# EasyEDA Pro project ProPrj_飞行器设计之5.8Ghz图传_2025-12-20.epro, board PCB_2
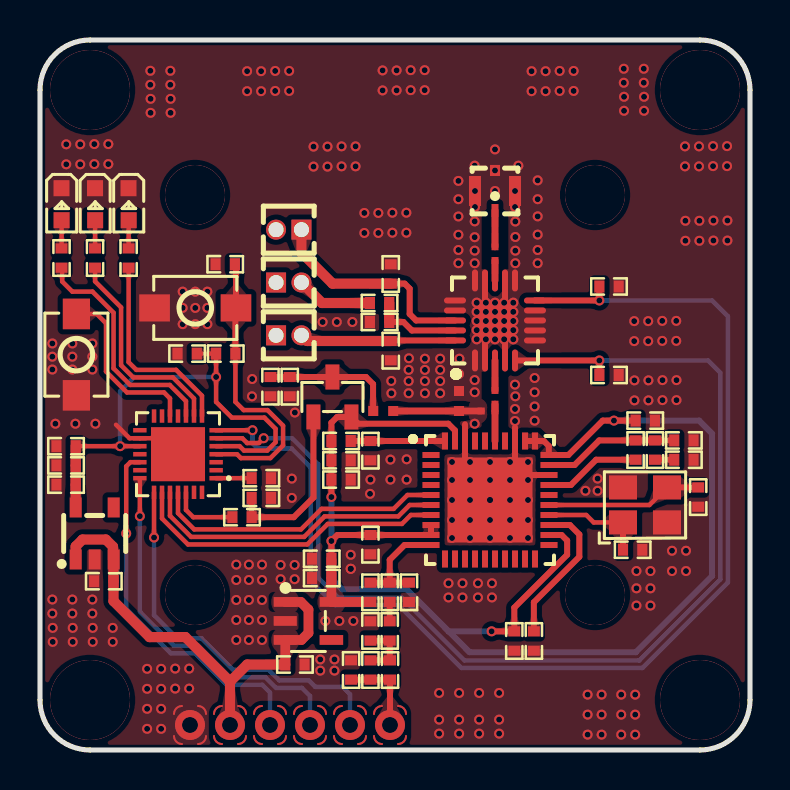
[diagram p11: board, top side]
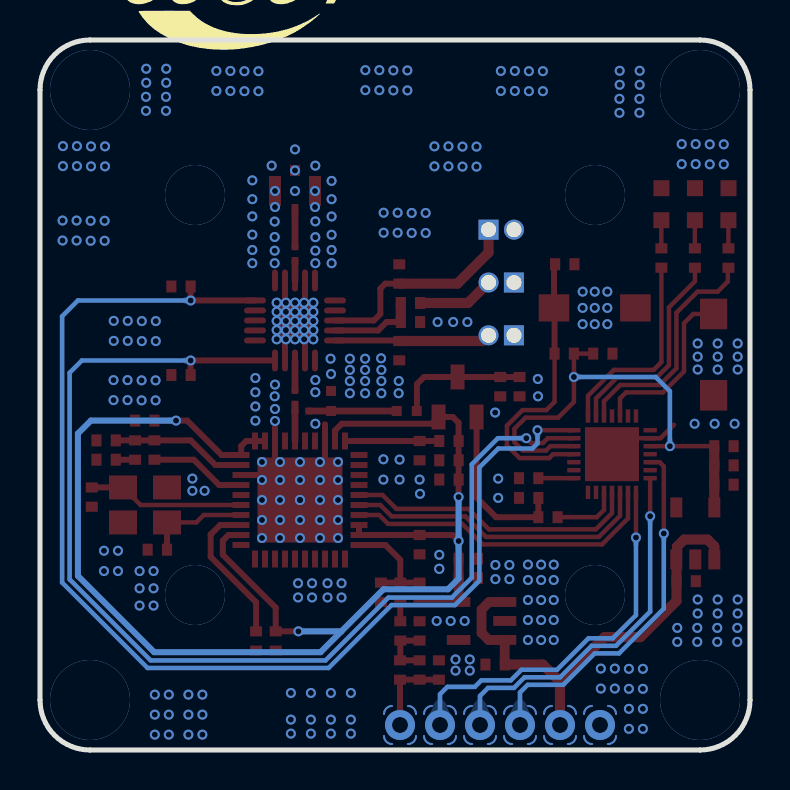
[diagram p12: board, bottom side, seen from below]

Outline 35.5 x 35.5 mm; copper layers: Top Layer, Inner1, Inner2, Bottom Layer. Coordinates in mm from the lower left corner of the outline.
Outline path: 0,33 arc(0.73,34.77) 2.5,35.5 33,35.5 arc(34.77,34.77) 35.5,33 35.5,2.5 arc(34.77,0.73) 33,0 2.5,0 arc(0.73,0.73) 0,2.5 0,33
Stack: Top Layer 0.035mm / Dielectric1 0.48mm PP er 4.5 / Inner1 0.035mm / Dielectric2 0.48mm FR4 er 4.5 / Inner2 0.035mm / Dielectric3 0.48mm PP er 4.5 / Bottom Layer 0.035mm

## Design rules (mm)
spacing safeClearance (default): track to track 0.152, other pairs 0.152 to 0.3
spacing Plane_innerPlane: track to track 0.152, other pairs 0.152 to 0.3
spacing Copper_copperRegion: track to track 0.152, other pairs 0.152 to 0.3
track width trackWidth (default): min 0.127, default 0.254, max 2.54
differential pair differentialPair (default): width min 0.127, default 0.254, max 2.54; gap min 0.152, default 0.152
pour e689 uses Copper_copperRegion
pour e694 uses Copper_copperRegion

## Placement (name value [footprint] x y rotation side)
C1  2.2uF  [C0402]  16.98 21.4 180 top
C2  2.2uF  [C0402]  17.54 19.97 90 top
C3  2.2uF  [C0402]  17.54 23.8 90 top
C4  1uF  [C0402]  11.52 18.17 90 top
C5  20pF  [C0402-0.5]  20.95 17.45 270 top
C6  7.3pF  [c0201]  22.75 17.63 90 top
C7  10pF  [c0201]  22.75 24.82 90 top
C8  1nF  [C0402]  28.45 18.75 0 top
C9  10pF  [C0402]  28.45 23.18 180 top
C10  1uF  [C0402]  15.05 14.48 180 top
C11  1uF  [C0402]  15.05 13.52 180 top
C12  10uf  [C0402]  12.49 18.17 90 top
C13  10pF  [C0402]  29.63 10.01 0 top
C14  10pF  [C0402]  32.91 12.65 270 top
C16  1nF  [C0402]  16.52 14.97 270 top
C17  4.7uF  [C0402]  30.26 16.47 180 top
C18  4.7uF  [C0402]  32.19 14.51 180 top
C19  1uF  [C0402]  32.19 15.48 180 top
C20  1uF  [C0402]  3.19 8.44 0 top
C21  104  [C0402]  1.3 14.23 0 top
C22  10uF  [C0402]  1.3 13.27 0 top
C23  1uF  [C0402]  16.52 10.27 270 top
C24  470nF  [C0402]  24.69 5.45 270 top
C25  4.7uF  [C0402]  17.49 5.95 270 top
C26  1uF  [C0402]  23.72 5.45 270 top
C27  56pF  [C0402]  16.52 4 90 top
C28  104  [C0402]  9.26 24.29 180 top
C29  104  [C0402]  7.36 19.82 180 top
C30  104  [C0402]  1.3 15.19 180 top
C32  10uf  [C0402]  11.07 12.61 180 top
C33  1uF  [C0402]  12.75 4.27 180 top
C34  104  [C0402]  14.09 9.56 0 top
C35  10uF  [C0402]  14.09 8.6 0 top
H1  KH-1.27PH180-1X2P-L7.2  [HDR-TH_2P-P1.27-V-M]  12.44 23.38 0 top
H2  KH-1.27PH180-1X2P-L7.2  [HDR-TH_2P-P1.27-V-M]  12.44 20.73 0 top
H3  KH-1.27PH180-1X2P-L7.2  [HDR-TH_2P-P1.27-V-M]  12.44 26.02 180 top
L1  12nH  [l0201]  22.41 16.95 0 top
LDO1  XC6204B332MR  [SOT-23-5_L3.0-W1.7-P0.95-LS2.8-BR]  2.74 10.83 270 top
LED1  XL-1608UBC-04  [LED0603-RD_BLUE]  1.08 27.29 270 top
LED2  XL-1608UBC-04  [LED0603-RD_BLUE]  2.75 27.29 270 top
LED3  XL-1608UBC-04  [LED0603-RD_BLUE]  4.43 27.29 270 top
Q1  FDN338P  [SOT-23-3_L2.9-W1.3-P1.90-LS2.4-BR]  14.62 17.65 270 top
R1  10ohm  [R0402-0.5]  17.16 16.95 180 top
R3  51ohm  [R0402]  15.05 15.45 180 top
R8  47k  [R0402]  30.75 15 270 top
R11  100k  [R0402]  29.78 15 90 top
R15  510k  [R0402]  16.52 7.89 270 top
R16  200ohm  [R0402]  16.52 5.95 270 top
R17  3.3k  [R0402]  17.49 7.89 90 top
R18  560K  [R0402]  18.45 7.89 90 top
R19  1.2k  [R0402]  17.5 4 90 top
R20  82ohm  [R0402]  15.56 4 270 top
R21  0ohm  [R0402]  16.98 22.35 180 top
R22  10K  [R0402]  11.07 13.59 180 top
R23  10K  [R0402]  9.29 19.82 0 top
R24  330Ω  [R0402]  1.08 24.6 90 top
R25  330Ω  [R0402]  2.75 24.6 90 top
R26  330Ω  [R0402]  4.43 24.6 90 top
R27  3.3kΩ  [R0402]  10.1 11.64 0 top
RF3  SP-RF-003  [IPEX-SMD_SP-RF-003]  22.75 27.98 90 top
SW3  TS342A2P-WZ  [SW-SMD_L4.0-W2.9-LS5.0]  7.76 22.11 0 top
SW4  TS342A2P-WZ  [SW-SMD_L4.0-W2.9-LS5.0]  1.82 19.77 270 top
T1  -  [test_pad#3]  13.5 1.25 270 bottom
T2  -  [TEST_PAD]  13.5 1.25 90 top
T3  -  [test_pad#4]  13.17 -2.53 270 bottom
T4  -  [test_pad]  9.46 -1.16 90 top
T5  -  [test_pad#5]  11.14 -5.63 270 bottom
T6  -  [test_pad#2]  8.75 -4.87 90 top
T7  -  [TEST_PAD]  17.5 1.25 90 top
T8  -  [TEST_PAD]  17.5 1.25 270 bottom
T9  -  [TEST_PAD]  11.5 1.25 270 bottom
T10  -  [TEST_PAD]  11.5 1.25 90 top
T11  -  [test_pad#3]  15.5 1.25 270 bottom
T12  -  [TEST_PAD]  15.5 1.25 90 top
U1  RFPA5542TR13  [QFN-20_L4.0-W4.0]  22.75 21.48 0 top
U3  -  [QFN-40-1]  22.5 12.5 0 top
U4  GD32F130G6U6TR  [QFN-28_L4.0-W4.0-P0.40-BL-EP]  6.9 14.79 90 top
U5  LP3992-36B5F  [SOT-23-5_L3.0-W1.7-P0.95-LS2.8-BL]  13.42 6.45 270 top
X3  8MHz  [OSC-SMD_4P-L3.2-W2.5-BL]  30.25 12.25 0 top

## Footprints (pads in the part's own frame, mm; a bottom-side part is the same pattern mirrored in y, then rotated)
c0201
  rect 0.343x0.343 smd: 1(-0.343,0) 2(0.343,0)
C0402
  rect 0.508x0.6 smd: 1(-0.483,0) 2(0.483,0)
C0402-0.5
  rect 0.5x0.5 smd: 1(-0.5,0) 2(0.5,0)
HDR-TH_2P-P1.27-V-M
  rect 1.001x1.001 hole 0.75: 1(-0.635,0)
  round 1.001 hole 0.75: 2(0.635,0)
IPEX-SMD_SP-RF-003
  rect 0.65x0.343 smd: 1(-1.001,0)
  rect 0.551x0.5 smd: 2(1.001,0)
  rect 1.501x0.6 smd: 3(-0.025,1.001) 4(-0.025,-1.001)
l0201
  rect 0.343x0.343 smd: 1(-0.343,0) 2(0.343,0)
LED0603-RD_BLUE
  rect 0.8x0.8 smd: 1(-0.8,-0.003) 2(0.8,0.003)
OSC-SMD_4P-L3.2-W2.5-BL
  rect 1.4x1.2 smd: 1(-1.1,-0.875) 2(1.1,-0.875) 3(1.1,0.875) 4(-1.1,0.875)
QFN-20_L4.0-W4.0
  oval 0.3x1.1 smd: 1(-1,-2) 2(-0.5,-2) 3(0,-2) 4(0.5,-2) 5(1,-2) 11(1,2) 12(0.5,2) 13(0,2) 14(-0.5,2) 15(-1,2)
  oval 1.1x0.3 smd: 6(2,-1) 7(2,-0.5) 8(2,0) 9(2,0.5) 10(2,1) 16(-2,1) 17(-2,0.5) 18(-2,0) 19(-2,-0.5) 20(-2,-1)
  rect 2x2 smd: 21(0,0)
QFN-28_L4.0-W4.0-P0.40-BL-EP
  rect 0.224x0.665 smd: 1(-1.199,-1.907) 2(-0.8,-1.907) 3(-0.399,-1.907) 4(0,-1.907) 5(0.402,-1.907) 6(0.8,-1.907) 7(1.199,-1.907) 15(1.199,1.907) 16(0.8,1.907) 17(0.402,1.907) 18(0,1.907) 19(-0.399,1.907) 20(-0.8,1.907) 21(-1.199,1.907)
  rect 0.665x0.224 smd: 8(1.907,-1.199) 9(1.907,-0.8) 10(1.907,-0.399) 11(1.907,0) 12(1.907,0.402) 13(1.907,0.8) 14(1.907,1.199) 22(-1.907,1.199) 23(-1.907,0.8) 24(-1.907,0.402) 25(-1.907,0) 26(-1.907,-0.399) 27(-1.907,-0.8) 28(-1.907,-1.199)
  rect 2.7x2.7 smd: 29(0,0)
QFN-40-1
  rect 0.85x0.3 smd: 1(-2.95,2.25) 2(-2.95,1.75) 3(-2.95,1.25) 4(-2.95,0.75) 5(-2.95,0.25) 6(-2.95,-0.25) 7(-2.95,-0.75) 8(-2.95,-1.25) 9(-2.95,-1.75) 10(-2.95,-2.25) 21(2.95,-2.25) 22(2.95,-1.75) 23(2.95,-1.25) 24(2.95,-0.75) 25(2.95,-0.25) 26(2.95,0.25) 27(2.95,0.75) 28(2.95,1.25) 29(2.95,1.75) 30(2.95,2.25)
  rect 0.3x0.85 smd: 11(-2.25,-2.95) 12(-1.75,-2.95) 13(-1.25,-2.95) 14(-0.75,-2.95) 15(-0.25,-2.95) 16(0.25,-2.95) 17(0.75,-2.95) 18(1.25,-2.95) 19(1.75,-2.95) 20(2.25,-2.95) 31(2.25,2.95) 32(1.75,2.95) 33(1.25,2.95) 34(0.75,2.95) 35(0.25,2.95) 36(-0.25,2.95) 37(-0.75,2.95) 38(-1.25,2.95) 39(-1.75,2.95) 40(-2.25,2.95)
  rect 4.25x4.25 smd: 41(0,0)
R0402
  rect 0.508x0.6 smd: 1(-0.483,0) 2(0.483,0)
R0402-0.5
  rect 0.5x0.5 smd: 1(-0.5,0) 2(0.5,0)
SOT-23-3_L2.9-W1.3-P1.90-LS2.4-BR
  rect 1.25x0.7 smd: 1(1,-0.95) 2(1,0.95) 3(-1,0)
SOT-23-5_L3.0-W1.7-P0.95-LS2.8-BL
  rect 0.49x1.157 smd: 1(-0.95,-1.153) 2(0,-1.153) 3(0.95,-1.153)
  rect 0.49x1.175 smd: 4(0.95,1.153) 5(-0.95,1.153)
SOT-23-5_L3.0-W1.7-P0.95-LS2.8-BR
  rect 1x0.6 smd: 1(1.3,-0.95) 2(1.3,0) 3(1.3,0.95) 4(-1.3,0.95) 5(-1.3,-0.95)
SW-SMD_L4.0-W2.9-LS5.0
  rect 1.53x1.36 smd: 1(-2.035,0) 2(2.035,0)
TEST_PAD
  custom 1.9x1.6 smd: 1(0,0)
test_pad
  custom 1.9x1.6 smd: 1(2.408,-0.041)
test_pad#2
  custom 1.9x1.6 smd: 1(6.116,1.248)
test_pad#3
  custom 1.9x1.6 smd: 1(0,0)
test_pad#4
  custom 1.9x1.6 smd: 1(-3.779,3.668)
test_pad#5
  custom 1.9x1.6 smd: 1(-6.878,3.636)

## Nets
As in the schematic.

Pads without a net: LDO1 4; U3 1 2 3 4 11 12 13 14 15 16 17 18 19 20 21 26 34 36 37; U4 2 3 11 13 14 15 18 20 27 28; U5 4

## Via types
v1: diameter 4, hole 4, Top Layer to Bottom Layer, 4 vias
v2: diameter 3, hole 3, Top Layer to Bottom Layer, 4 vias
v3: diameter 0.5, hole 0.3, Top Layer to Bottom Layer, 326 vias
v4: diameter 0.508, hole 0.305, Top Layer to Bottom Layer, 25 vias
v5: diameter 1.5, hole 0.8, Top Layer to Bottom Layer, 6 vias

## Routing (per net, layer and track width the routed paths; a pad name or vN(x,y) marks a point on that pad's centre or on a via; arc(x,y) is an arc through that point)
+3.3VGD: length 24.9
  Top Layer w0.224: C29.1 R23.1 v3(8.81,18.65) 8.81,17.41 9.59,16.62 11.22,16.62 11.78,16.06 11.78,15.39 11.36,14.97 10.2,14.97 9.98,15.19 U4.5 ; U4.17 v3(4,15.19) C30.1
  Top Layer w0.508: C30.1 C21.2 C22.2 1.78,12.13
  Bottom Layer w0.224: v3(4,15.19) 4,17.94 4.72,18.65 v3(8.81,18.65)
+3.6V: length 76.7
  Top Layer w0.3: v3(14.57,12.65) C11.2 C10.2 R3.2 14.57,16.36 14.86,16.65 Q1.2 15.91,16.31 20.41,16.31 20.75,15.98 U3.39 ; U3.22 26.08,10.75 26.36,10.47 26.36,9.76 23.72,7.12 C26.1 v3(22.58,5.93) ; C17.2 v3(28.7,16.47) 28.14,16.47 26.42,14.75 U3.30 25.44,14.76 25.44,15.2 25.19,15.45 U3.31 U3.32 ; U3.8 U3.9 C23.1 14.87,10.75 v3(14.57,10.45) C34.2
  Top Layer w0.49: C34.2 C35.2 U5.5 R15.2
  Bottom Layer w0.3: v3(22.58,5.93) 20.43,5.93 ; 20.43,5.93 18.33,8.04 15.1,8.04 14.57,8.57 v3(14.57,10.45) v3(14.57,12.65) ; 20.43,5.93 21.47,4.89 29.79,4.89 33.6,8.7 33.6,15.82 32.96,16.47 v3(28.7,16.47)
+4V5: length 23.3
  Top Layer w0.49: C33.2 U5.3 13.07,5.5 13.42,5.85 13.42,7.02 13.04,7.4 U5.1
  Top Layer w0.508: 1.78,9.53 1.78,10.18 2.12,10.52 3.29,10.52 3.65,10.17 3.65,9.54 3.68,9.52 ; 3.68,9.52 C20.2 3.68,7.45 5.48,5.65 7.27,5.65 9.5,3.42 ; 3.68,9.52 LDO1.3 ; v5(9.5,1.25) 9.5,3.42 ; 9.5,3.42 10.36,4.27 C33.2
GND: length 22.7
  Top Layer w0.224: U4.29 6.1,15.59 U4.16 4.47,15.59 3.8,16.26
  Top Layer w0.3: 23.75,13.75 U3.33 23.75,16.13 ; 23.75,13.75 U3.28 ; 23.75,13.75 v3(23.5,13.5) v3(22.5,12.5) v3(21.5,13.5) 21.25,13.75 U3.38 21.25,16.29 ; 22.74,21.46 v4(22.75,21.45) ; 22.74,21.46 22.25,21.95 U1.14 ; 22.74,21.46 22.25,20.98 U1.2 ; 22.74,21.46 U1.21 ; v4(22.75,21.45) 23.25,21.95 U1.12 ; v4(22.75,21.45) 23.25,20.95 U1.4
  vias: v3(0.62,20.33) v3(0.62,19.67) v3(0.62,19.02) v3(0.62,7.53) v3(0.62,6.83) v3(0.64,6.11) v3(0.64,5.41) v3(0.77,16.31) v3(1.31,30.28) v3(1.31,29.28) v3(1.62,20.33) v3(1.62,19.67) v3(1.62,19.02) v3(1.62,7.53) v3(1.62,6.83) v3(1.64,6.11) v3(1.64,5.41) v3(1.77,16.31) v3(2.01,30.28) v3(2.01,29.28) v3(2.62,20.33) v3(2.62,19.67) v3(2.62,19.02) v3(2.62,7.53) v3(2.62,6.83) v3(2.64,6.11) v3(2.64,5.41) v3(2.72,30.3) v3(2.72,29.3) v3(2.77,16.31) v3(3.42,30.3) v3(3.42,29.3) v3(3.64,6.11) v3(3.64,5.41) v3(5.36,4.06) v3(5.36,3.06) v3(5.36,2.06) v3(5.36,1.06) v3(5.52,33.96) v3(5.52,33.26) v3(5.53,32.56) v3(5.53,31.86) v3(6.06,4.06) v3(6.06,3.06) v3(6.06,2.06) v3(6.06,1.06) v3(6.52,33.96) v3(6.52,33.26) v3(6.53,32.56) v3(6.53,31.86) v3(6.76,4.07) v3(6.76,3.07) v3(7.13,22.92) v3(7.13,22.11) v3(7.13,21.29) v3(7.46,4.07) v3(7.46,3.07) v3(7.76,22.92) v3(7.76,22.11) v3(7.76,21.29) v3(8.37,22.92) v3(8.37,22.11) v3(8.37,21.29) v3(9.81,9.27) v3(9.81,8.5) v3(9.81,7.5) v3(9.81,6.5) v3(9.81,5.5) v3(10.36,33.94) v3(10.36,32.94) v3(10.44,9.27) v3(10.44,8.5) v3(10.44,7.5) v3(10.44,6.5) v3(10.44,5.5) v3(10.61,18.55) v3(10.6,17.68) v3(11.06,33.94) v3(11.06,32.94) v3(11.1,9.27) v3(11.1,8.5) v3(11.1,7.5) v3(11.1,6.5) v3(11.1,5.5) v3(11.76,33.95) v3(11.76,32.95) v3(12.03,9.25) v3(12.03,8.54) v3(12.46,33.95) v3(12.46,32.95) v3(12.59,13.57) v3(12.59,12.61) v3(12.74,16.87) v3(12.73,9.25) v3(12.73,8.54) v3(13.68,30.17) v3(13.68,29.17) v3(14.01,4.53) v3(14.01,3.97) v3(14.13,21.4) v3(14.27,6.45) v3(14.38,30.17) v3(14.38,29.17) v3(14.72,4.53) v3(14.72,3.97) v3(14.84,21.4) v3(14.97,6.45) v3(15.08,30.18) v3(15.08,29.18) v3(15.54,9.76) v3(15.54,9.06) v3(15.54,9.06) v3(15.62,21.4) v3(15.67,6.45) v3(15.78,30.18) v3(15.78,29.18) v3(16.22,26.85) v3(16.22,25.85) v3(16.52,13.52) v3(16.5,12.81) v3(16.92,26.85) v3(16.92,25.85) v3(17.13,33.98) v3(17.13,32.98) v3(17.52,14.52) v3(17.52,13.52) v3(17.62,26.86) v3(17.62,25.86) v3(17.56,18.45) v3(17.57,17.84) v3(17.83,33.98) v3(17.83,32.98) v3(18.32,26.86) v3(18.32,25.86) v3(18.33,14.54) v3(18.33,13.52) v3(18.45,19.59) v3(18.43,19.01) v3(18.43,18.45) v3(18.43,17.84) v3(18.53,33.99) v3(18.53,32.99) v3(19.23,33.99) v3(19.23,32.99) v3(19.25,19.57) v3(19.25,19.01) v3(19.25,18.45) v3(19.25,17.84) v3(20.01,19.57) v3(20.01,19.01) v3(20.01,18.45) v3(20.01,17.84) v3(19.96,2.85) v3(19.96,1.52) v3(19.96,0.82) v3(20.42,8.34) v3(20.42,7.63) v3(20.6,14.4) v3(20.6,13.5) v3(20.6,12.5) v3(20.6,11.5) v3(20.6,10.6) v3(20.92,28.46) v3(20.92,27.54) v3(20.92,26.68) v3(20.92,25.76) v3(20.92,25) v3(20.92,24.34) v3(20.97,19.57) v3(20.95,18.8) v3(20.96,2.85) v3(20.96,1.52) v3(20.96,0.82) v3(21.12,8.34) v3(21.12,7.63) v3(21.5,14.4) v3(21.5,12.5) v3(21.5,11.5) v3(21.5,10.6) v3(21.73,29.22) v3(21.75,27.95) v3(21.75,27.15) v3(21.73,26.43) v3(21.73,25.64) v3(21.73,24.97) v3(21.73,24.34) v3(21.73,18.5) v3(21.73,17.89) v3(21.73,16.31) v3(21.9,8.34) v3(21.9,7.63) v3(21.96,2.85) v3(21.96,1.52) v3(21.96,0.82) v3(22.5,14.4) v3(22.5,13.5) v3(22.5,11.5) v3(22.5,10.6) v3(22.6,8.34) v3(22.6,7.63) v3(22.75,30.03) v3(22.75,28.98) v3(22.75,27.95) v3(22.96,2.85) v3(22.96,1.52) v3(22.96,0.82) v3(23.5,14.4) v3(23.5,12.5) v3(23.5,11.5) v3(23.5,10.6) v3(23.75,18.27) v3(23.75,17.05) v3(23.75,16.45) v3(23.75,27.95) v3(23.75,27.15) v3(23.77,26.42) v3(23.77,25.65) v3(23.77,24.97) v3(23.77,24.34) v3(23.77,17.69) v3(23.92,29.22) v3(24.4,14.4) v3(24.4,13.5) v3(24.4,12.5) v3(24.4,11.5) v3(24.4,10.6) v3(24.58,33.94) v3(24.58,32.94) v3(24.73,18.6) v3(24.73,17.89) v3(24.73,17.18) v3(24.73,16.47) v3(24.88,28.48) v3(24.88,27.54) v3(24.88,26.68) v3(24.88,25.77) v3(24.88,25) v3(24.88,24.34) v3(25.28,33.94) v3(25.28,32.94) v3(25.98,33.95) v3(25.98,32.95) v3(26.68,33.95) v3(26.68,32.95) v3(27.27,12.96) v3(27.38,2.77) v3(27.38,1.77) v3(27.38,0.77) v3(27.88,13.57) v3(27.88,12.96) v3(28.08,2.77) v3(28.08,1.77) v3(28.08,0.77) v3(29.06,2.77) v3(29.06,1.77) v3(29.06,0.77) v3(29.19,34.06) v3(29.19,33.36) v3(29.2,32.66) v3(29.2,31.96) v3(29.71,21.44) v3(29.71,20.44) v3(29.72,18.48) v3(29.72,17.48) v3(29.82,8.95) v3(29.82,8.08) v3(29.82,7.22) v3(29.76,2.77) v3(29.76,1.77) v3(29.76,0.77) v3(30.19,34.06) v3(30.19,33.36) v3(30.2,32.66) v3(30.2,31.96) v3(30.41,21.44) v3(30.41,20.44) v3(30.42,18.48) v3(30.42,17.48) v3(30.52,8.95) v3(30.52,8.08) v3(30.52,7.22) v3(31.11,21.46) v3(31.11,20.46) v3(31.12,18.49) v3(31.12,17.49) v3(31.6,9.96) v3(31.6,8.95) v3(31.81,21.46) v3(31.81,20.46) v3(31.82,18.49) v3(31.82,17.49) v3(32.25,30.18) v3(32.25,29.18) v3(32.27,26.46) v3(32.27,25.46) v3(32.3,9.96) v3(32.3,8.95) v3(32.95,30.18) v3(32.95,29.18) v3(32.97,26.46) v3(32.97,25.46) v3(33.65,30.19) v3(33.65,29.19) v3(33.67,26.47) v3(33.67,25.47) v3(34.35,30.19) v3(34.35,29.19) v3(34.37,26.47) v3(34.37,25.47) v4(21.84,22.36) v4(21.84,21.91) v4(21.84,21.45) v4(21.84,20.99) v4(21.84,20.54) v4(22.29,22.36) v4(22.29,21.91) v4(22.29,21.45) v4(22.29,20.99) v4(22.29,20.54) v4(22.75,22.36) v4(22.75,21.91) v4(22.75,20.99) v4(22.75,20.54) v4(23.21,22.36) v4(23.21,21.91) v4(23.21,21.45) v4(23.21,20.99) v4(23.21,20.54) v4(23.66,22.36) v4(23.66,21.91) v4(23.66,21.45) v4(23.66,20.99) v4(23.66,20.54) v5(7.5,1.25)
(no net):
  vias: v1(2.5,33) v1(2.5,2.5) v1(33,33) v1(33,2.5) v2(7.75,27.75) v2(7.75,7.75) v2(27.75,27.75) v2(27.75,7.75)
CS: length 15.3
  Top Layer w0.224: U3.6 18.48,12.25 17.91,11.68 14.23,11.68 13.21,10.65 7.56,10.65 6.5,11.71 U4.24
DATA: length 14.7
  Top Layer w0.224: U4.25 6.9,11.84 7.71,11.03 13.05,11.03 14.08,12.06 17.68,12.06 18.37,12.75 U3.5
RTC_BIAS: length 3.3
  Top Layer w0.224: U4.26 7.3,12 7.66,11.64 R27.1
RX: length 18.4
  Top Layer w0.224: v3(4.31,10.83) 4.31,14.18 4.52,14.39 4.99,14.39
  Bottom Layer w0.224: v5(11.5,1.25) 11.5,2.88 11.12,3.26 9.34,3.26 7.76,4.83 6.55,4.83 4.31,7.07 v3(4.31,10.83)
SCK: length 15.9
  Top Layer w0.224: U4.23 6.1,11.58 7.4,10.28 13.36,10.28 14.39,11.3 18.1,11.3 18.54,11.75 U3.7
SWCLK: length 19.1
  Top Layer w0.224: U4.22 v3(5.7,10.62)
  Bottom Layer w0.224: v5(15.5,1.25) 15.5,2.79 15.13,3.16 13.76,3.16 13.43,3.48 11.96,3.48 11.43,4.01 9.65,4.01 8.08,5.59 6.86,5.59 5.7,6.74 v3(5.7,10.62)
SWDAT: length 18.4
  Top Layer w0.224: v3(4.99,11.69) U4.21
  Bottom Layer w0.224: v3(4.99,11.69) 4.99,6.92 6.7,5.21 7.92,5.21 9.49,3.63 11.27,3.63 11.8,3.11 13.1,3.11 13.5,2.7 v5(13.5,1.25)
VIDEO: length 4.2
  Top Layer w0.3: R20.2 C27.1 R19.1 v5(17.5,1.25)
VPD: length 60
  Top Layer w0.224: U4.7 v3(10.62,15.99)
  Top Layer w0.3: U1.10 v3(27.97,22.48) ; v3(27.97,22.48) C9.2 ; v3(27.97,22.48) 27.97,22.45
  Bottom Layer w0.224: v3(10.62,15.99) 10.62,15.33 10.88,15.08 12.58,15.08 13.53,14.13 13.53,8.46 14.75,7.25 17.92,7.25 21.07,4.1 30.12,4.1 34.4,8.38 34.4,21.69 33.61,22.48 v3(27.97,22.48)
VREF: length 56.6
  Top Layer w0.224: v3(11.18,15.59) 10.94,15.35 10.36,15.35 10.11,15.59 U4.6
  Top Layer w0.3: C8.1 v3(27.97,19.48) U1.5
  Bottom Layer w0.224: v3(27.97,19.48) 33.41,19.48 34.02,18.86 34.02,8.53 29.96,4.48 21.23,4.48 18.08,7.62 14.9,7.62 13.91,8.62 13.91,14.28 12.6,15.59 v3(11.18,15.59)
$1N35430: length 5.4
  Top Layer w0.3: R17.2 R18.2 ; R17.2 17.49,9.51 18.23,10.25 U3.10 ; R17.2 R15.1
$1N35502: length 1
  Top Layer w0.3: C25.1 R17.1
$1N37428: length 2.9
  Top Layer w0.3: C27.2 R19.2 17.49,4.5 C25.2 R16.2
$1N43323: length 4.9
  Top Layer w0.3: R11.1 27.81,14.51 26.54,13.25 U3.27
$1N43978: length 1
  Top Layer w0.3: R8.2 C18.2
$1N44248: length 6.8
  Top Layer w0.3: U3.29 26.73,14.25 27.96,15.48 R11.2 R8.1 C19.2
$1N44995: length 7.8
  Top Layer w0.224: X3.3 30.47,12.25 U3.25
  Top Layer w0.3: C14.1 X3.3
$1N45085: length 5.2
  Top Layer w0.224: U3.24 27.31,11.75 27.69,11.38 X3.1
  Top Layer w0.3: C13.1 X3.1
$1N52247: length 4.7
  Top Layer w0.3: U3.40 C16.1 R3.1
$1N57648: length 4.4
  Top Layer w0.342: R1.1 C5.2 L1.1
$1N59286: length 1.5
  Top Layer w0.342: C6.2 U1.3
$1N64215: length 7.5
  Top Layer w0.3: U3.23 26.49,11.25 26.97,10.78 26.97,9.66 24.69,7.39 C24.1
$1N103981: length 1.8
  Top Layer w0.342: 22.75,25.16 22.75,26.98
$1N115820: length 7.8
  Top Layer w0.3: C2.2 17.56,20.48 U1.20
  Top Layer w0.508: C2.2 13.36,20.45 H2.2
$1N117066: length 11
  Top Layer w0.3: U1.18 18.81,21.48 18.48,21.8 18.48,23.07 18.24,23.32 C3.1
  Top Layer w0.508: C3.1 14.63,23.32 13.07,24.87 H3.1
$1N140523: length 4.4
  Top Layer w0.3: U1.19 18.6,20.98 18.17,21.4 C1.1
  Top Layer w0.508: R21.1 C1.1
$1N148789: length 1
  Top Layer w0.342: C7.1 U1.13
$1N149538: length 1.8
  Top Layer w0.342: 22.75,17.29 U3.35
$1N177069: length 1.8
  Top Layer w0.224: U4.1 10.58,13.59
$1N177434: length 14.5
  Top Layer w0.224: U4.4 9.85,14.79 10.04,14.6 11.52,14.6 12.15,15.23 12.15,16.22 11.37,17 10.18,17 9.77,17.41 R23.2
  Top Layer w0.3: C28.1 9.8,24.24 SW3.2 9.77,22.08 R23.2 arc(9.79,19.83) 9.8,19.85
$1N188735: length 10.1
  Top Layer w0.224: U4.8 8.1,17.71 6.81,19.01 4.82,19.01 4.43,19.39 4.43,24.12
$1N188888: length 10.6
  Top Layer w0.224: U4.9 7.7,17.57 6.64,18.63 4.66,18.63 4.05,19.24 4.05,22.13 2.75,23.43 2.75,24.12
$1N189041: length 11.7
  Top Layer w0.224: U4.10 7.3,17.44 6.49,18.25 4.51,18.25 3.68,19.08 3.68,21.86 2.62,22.92 1.62,22.92 1.11,23.43 1.11,24.08 1.08,24.12
$1N189742: length 8.7
  Top Layer w0.224: U4.12 6.5,17.58 6.2,17.88 4.35,17.88 3.3,18.93 3.3,21.34 2.83,21.8 1.82,21.8
$1N195519: length 1.4
  Top Layer w0.224: LED2.2 2.76,25.08 R25.2
$1N195672: length 1.4
  Top Layer w0.224: R26.2 4.43,25.08 LED3.2
$1N195825: length 1.4
  Top Layer w0.224: LED1.2 1.08,25.08 R24.2
$1N202366: length 8.5
  Top Layer w0.3: C32.2 R27.2 12.69,11.64 13.67,12.62 Q1.1
$1N212259: length 6.6
  Top Layer w0.3: R1.2 16.65,16.96 16.65,18.3 16.3,18.65 Q1.3 C12.2 C4.2
$1N216086: length 3.8
  Top Layer w0.508: H1.2 14.1,22.35 R21.2

## Copper pours and planes (outline as drawn; the poured copper is in the pictures)
GND on Top Layer: 19.55,30.49 26.13,30.49 26.13,12.5 19.55,12.5
GND on Top Layer: 0,33 0.73,34.77 2.5,35.5 33,35.5 34.77,34.77 35.5,33 35.5,2.5 34.77,0.73 33,0 2.5,0 0.73,0.73 0,2.5

Small or netless copper shapes (teardrops, artwork), in the pictures only: 207 on Top Layer, 20 on Bottom Layer
